# EasyEDA Pro project evenVCO.eprj, board PCB2_2
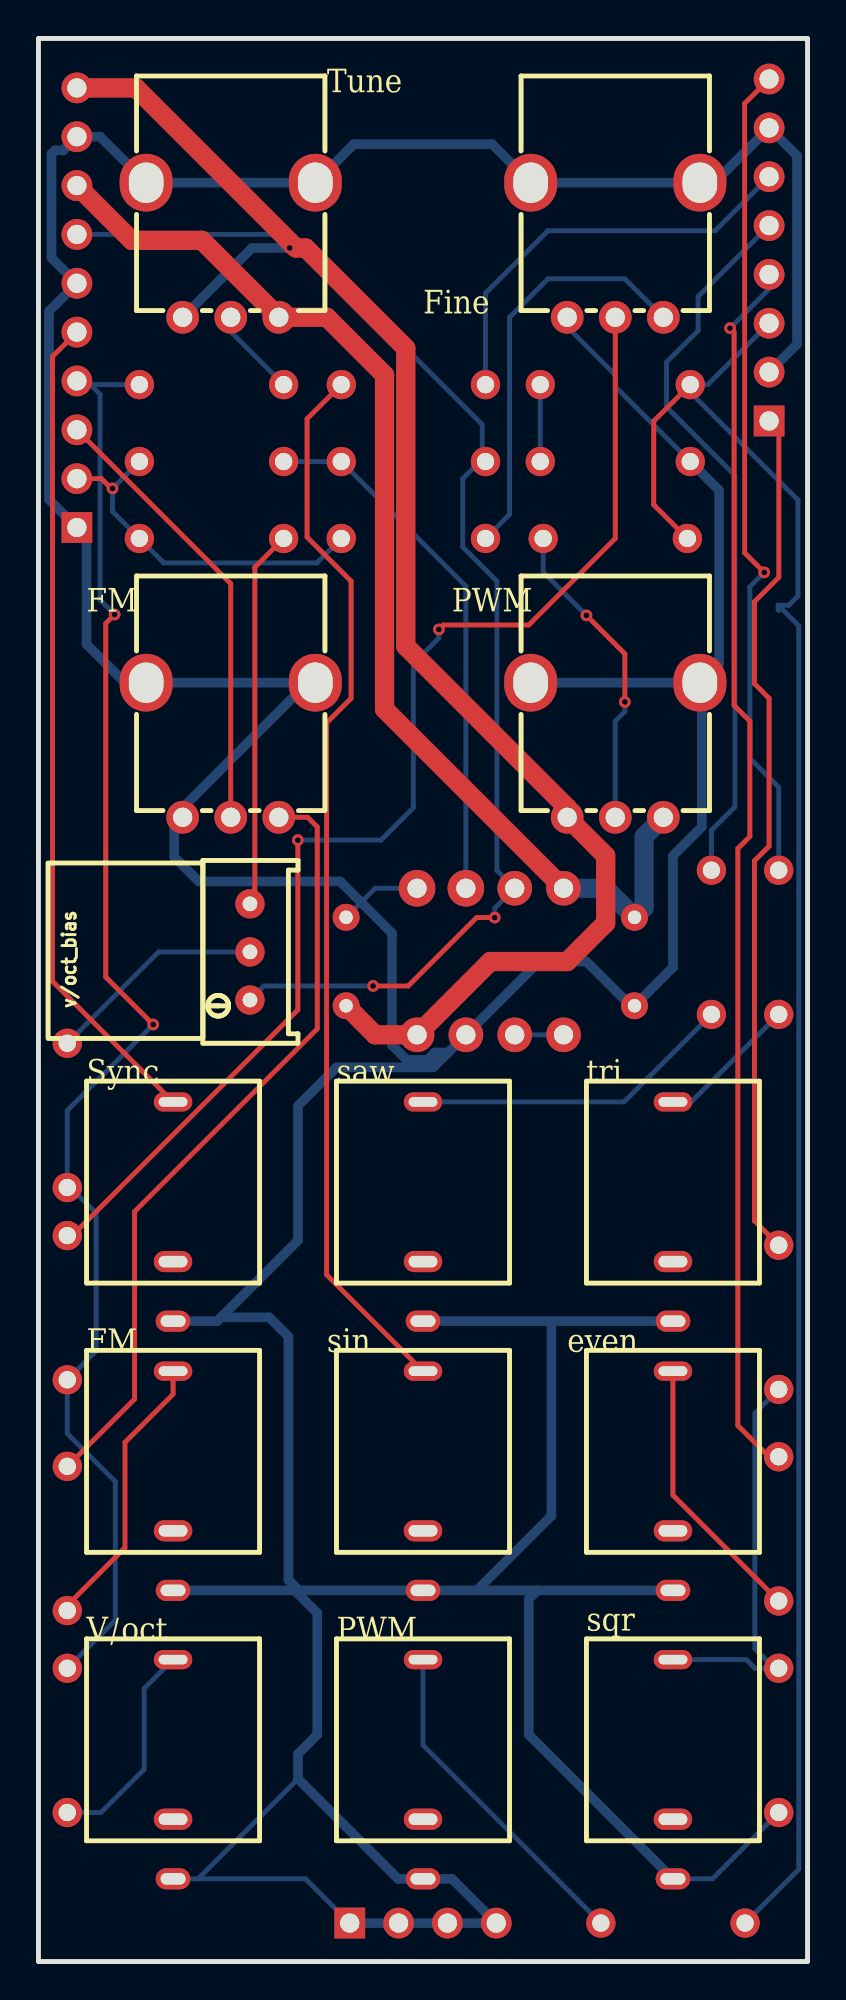
[diagram p12: board, top side]
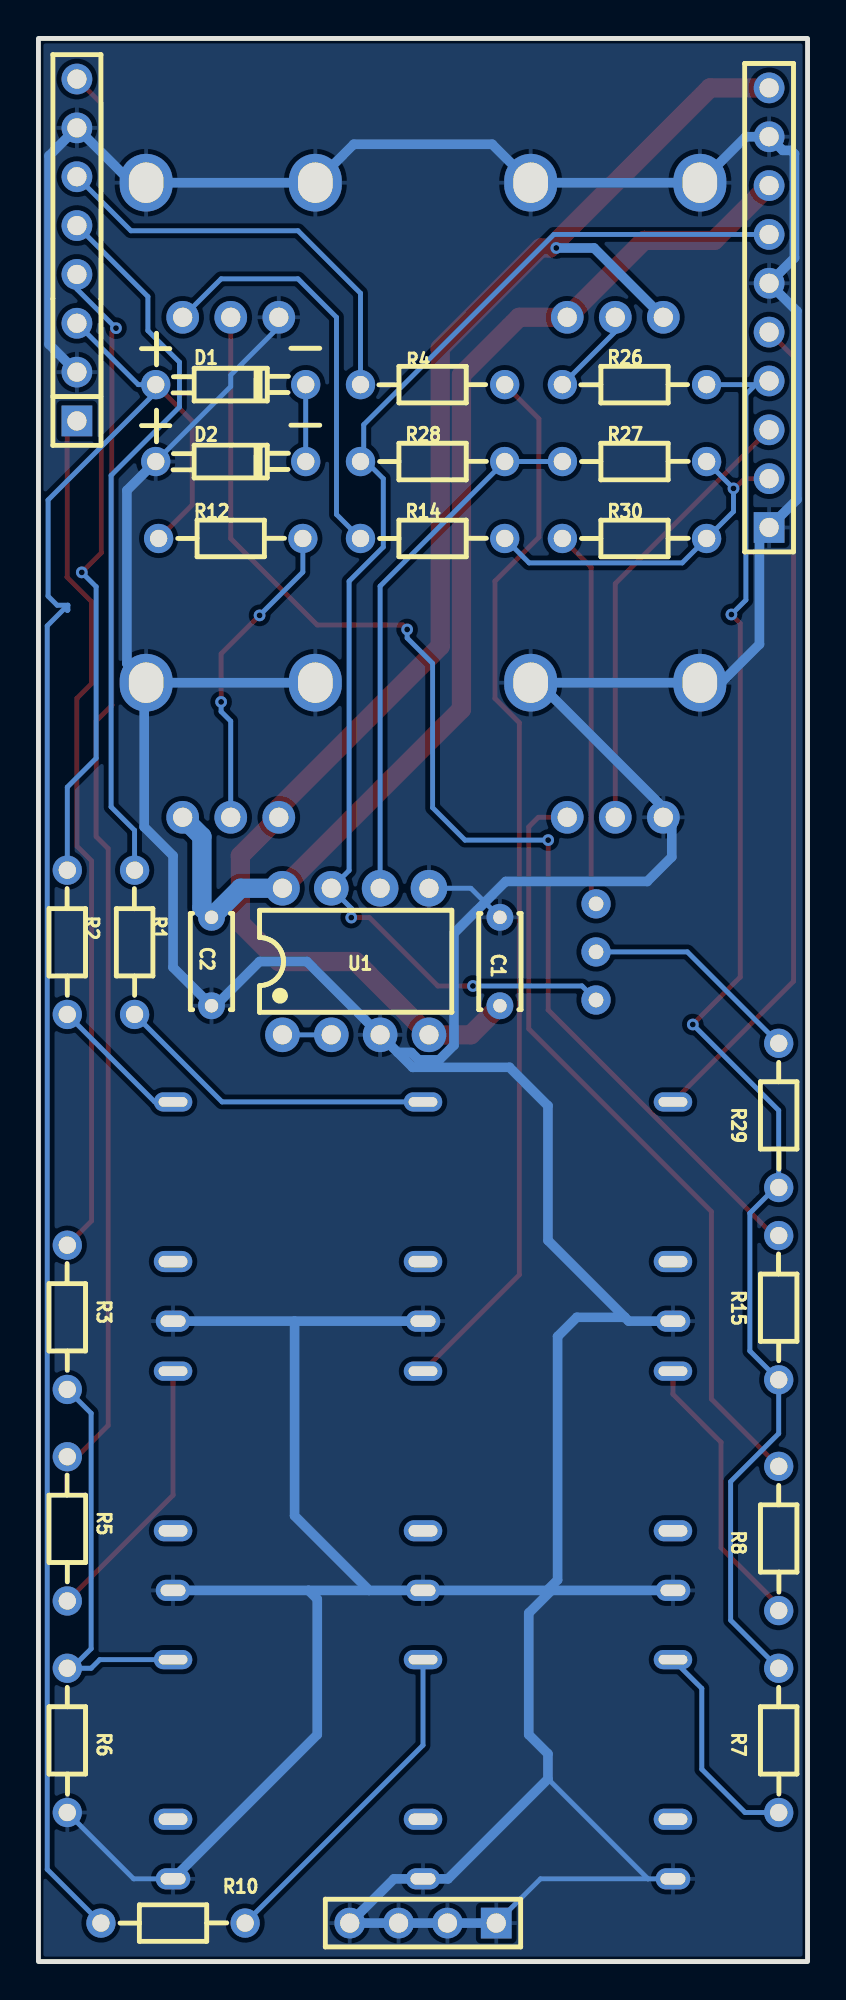
[diagram p13: board, bottom side, seen from below]

Outline 40 x 100 mm; copper layers: Top Layer, Bottom Layer. Coordinates in mm from the lower left corner of the outline.
Outline path: rectangle 0,100 40,0
Stack: Top Layer 0.035mm / Dielectric1 1.51mm FR4 er 4.5 / Bottom Layer 0.035mm

## Design rules (mm)
template: Custom Config
spacing copperThickness1oz (default): track to track 0.102, other pairs 0.152 to 0.3
spacing copperThickness2oz: track to track 0.203, other pairs 0.152 to 0.3
track width copperThickness1oz (default): min 0.127, default 0.254, max 2.54
track width copperThickness2oz: min 0.203, default 0.254, max 2.54
differential pair differentialPair (default): width min 0.127, default 0.254, max 2.54; gap min 0.152, default 0.152
via viaSize (default): diameter min 0.5, default 0.61, max 10; hole min 0.3, default 0.305, max 6.3

## Placement (name value [footprint] x y rotation side)
C1  100nF  [CAP-TH_L5.0-W2.1-P4.60-D0.4]  16 52 270 bottom
C2  100nF  [CAP-TH_L5.0-W2.1-P4.60-D0.4]  31 52 90 bottom
D1  BZX55C4V7-TAP  [DO-35_BD1.7-L3.8-P7.8-D0.5-FD]  30 82 180 bottom
D2  BZX55C4V7-TAP  [DO-35_BD1.7-L3.8-P7.8-D0.5-FD]  30 78 180 bottom
even  WQP-WQP518MA  [CONN-TH_WQP-WQP518MA]  33 25 0 top
Fine  100kΩ  [RES-ADJ-TH_RK09D1130C3C]  30 89 0 top
FM  WQP-WQP518MA  [RES-ADJ-TH_RK09D1130C3C]  10 63 0 top
FM#2  -  [CONN-TH_WQP-WQP518MA]  7 25 0 top
H1  HTSW-110-07-G-S  [HDR-TH_TSW-110-17-F-S-LL]  2 86 90 bottom
H2  HTSW-108-22-T-S  [HDR-TH_HTSW-108-22-T-S]  38 89 90 bottom
H3  HTSW-104-18-F-S  [HDR-TH_HTSW-104-25-S-S-LL]  20 2 180 bottom
PWM  WQP-WQP518MA  [RES-ADJ-TH_RK09D1130C3C]  30 63 0 top
PWM#2  -  [CONN-TH_WQP-WQP518MA]  20 10 0 top
R1  1k  [RES-TH_BD1.9-L3.5-P7.50-D0.5]  35 53 270 bottom
R2  1k  [RES-TH_BD1.9-L3.5-P7.50-D0.5]  38.5 53 270 bottom
R3  3.3k  [RES-TH_BD1.9-L3.5-P7.50-D0.5]  38.5 33.5 270 bottom
R4  1k  [RES-TH_BD1.9-L3.5-P7.50-D0.5]  19.5 82 180 bottom
R5  1k  [RES-TH_BD1.9-L3.5-P7.50-D0.5]  38.5 22.5 270 bottom
R6  3.3k  [RES-TH_BD1.9-L3.5-P7.50-D0.5]  38.5 11.5 90 bottom
R7  100k 0.1%  [RES-TH_BD1.9-L3.5-P7.50-D0.5]  1.5 11.5 90 bottom
R8  100K  [RES-TH_BD1.9-L3.5-P7.50-D0.5]  1.5 22 90 bottom
R10  47k  [RES-TH_BD1.9-L3.5-P7.50-D0.5]  33 2 0 bottom
R12  12k  [RES-TH_BD1.9-L3.5-P7.50-D0.5]  30 74 0 bottom
R14  130k  [RES-TH_BD1.9-L3.5-P7.50-D0.5]  19.5 74 0 bottom
R15  100k  [RES-TH_BD1.9-L3.5-P7.50-D0.5]  1.5 34 270 bottom
R26  50k .1%  [RES-TH_BD1.9-L3.5-P7.50-D0.5]  9 82 180 bottom
R27  10K  [RES-TH_BD1.9-L3.5-P7.50-D0.5]  9 78 0 bottom
R28  10K  [RES-TH_BD1.9-L3.5-P7.50-D0.5]  19.5 78 0 bottom
R29  100k  [RES-TH_BD1.9-L3.5-P7.50-D0.5]  1.5 44 90 bottom
R30  36k  [RES-TH_BD1.9-L3.5-P7.50-D0.5]  9 74 0 bottom
saw  WQP-WQP518MA  [CONN-TH_WQP-WQP518MA]  20 39 0 top
sin  WQP-WQP518MA  [CONN-TH_WQP-WQP518MA]  20 25 0 top
sqr  WQP-WQP518MA  [CONN-TH_WQP-WQP518MA]  33 10 0 top
Sync  WQP-WQP518MA  [CONN-TH_WQP-WQP518MA]  7 39 0 top
tri  WQP-WQP518MA  [CONN-TH_WQP-WQP518MA]  33 39 0 top
Tune  100kΩ  [RES-ADJ-TH_RK09D1130C3C]  10 89 0 top
U1  TL082CP  [PDIP-8_L9.6-W6.4-P2.54-LS7.6-BL]  23.5 52 180 bottom
V/oct  WQP-WQP518MA  [CONN-TH_WQP-WQP518MA]  7 10 0 top
v/oct_bias  10kΩ  [RES-ADJ-TH_3P-L10.0-W10.0-P2.50-L]  11 52.5 90 top

## Footprints (pads in the part's own frame, mm; a bottom-side part is the same pattern mirrored in y, then rotated)
CAP-TH_L5.0-W2.1-P4.60-D0.4
  round 1.4 hole 0.7: 1(-2.3,0) 2(2.3,0)
CONN-TH_WQP-WQP518MA
  oval 1.8x1.1 hole 1.3x0.6: 1(0,-5.7)
  oval 2x1.1 hole 1.5x0.6: 2(0,-2.6)
  oval 2x1 hole 1.5x0.5: 3(0,5.7)
DO-35_BD1.7-L3.8-P7.8-D0.5-FD
  round 1.524 hole 0.9: 1(3.9,0) 2(-3.9,0)
HDR-TH_HTSW-104-25-S-S-LL
  rect 1.6x1.6 hole 1: 1(3.81,0)
  round 1.6 hole 1: 2(1.27,0) 3(-1.27,0) 4(-3.81,0)
HDR-TH_HTSW-108-22-T-S
  rect 1.6x1.6 hole 1: 1(-8.89,0)
  round 1.6 hole 1: 2(-6.35,0) 3(-3.81,0) 4(-1.27,0) 5(1.27,0) 6(3.81,0) 7(6.35,0) 8(8.89,0)
HDR-TH_TSW-110-17-F-S-LL
  rect 1.6x1.6 hole 1: 1(-11.43,0)
  round 1.6 hole 1: 2(-8.89,0) 3(-6.35,0) 4(-3.81,0) 5(-1.27,0) 6(1.27,0) 7(3.81,0) 8(6.35,0) 9(8.89,0) 10(11.43,0)
PDIP-8_L9.6-W6.4-P2.54-LS7.6-BL
  round 1.8 hole 1: 1(-3.81,-3.81) 2(-1.27,-3.81) 3(1.27,-3.81) 4(3.81,-3.81) 7(-1.27,3.81) 8(-3.81,3.81)
  round 1.905 hole 1: 5(3.81,3.81) 6(1.27,3.81)
RES-ADJ-TH_3P-L10.0-W10.0-P2.50-L
  round 1.524 hole 0.762: 1(-2.5,0) 2(0,0) 3(2.5,0)
RES-ADJ-TH_RK09D1130C3C
  round 1.7 hole 1: 1(-2.5,-3.5) 2(0,-3.5) 3(2.5,-3.5)
  oval 2.75x3 hole 1.8x2.1: 4(-4.4,3.5) 5(4.4,3.5)
RES-TH_BD1.9-L3.5-P7.50-D0.5
  round 1.524 hole 0.9: 1(-3.75,0) 2(3.75,0)

## Nets
+12V: C2.2 H1.8 PWM.3 Tune.3 U1.8
-12V: C1.2 H1.10 PWM.1 Tune.1 U1.4
GND: C1.1 C2.1 D2.2 even.1 Fine.1 Fine.4 Fine.5 FM.1 FM.4 FM.5 FM#2.1 H1.1 H1.6 H1.9 H2.2 H2.7 H3.1 H3.2 H3.3 H3.4 PWM.4 PWM.5 PWM#2.1 R6.1 saw.1 sin.1 sqr.1 Sync.1 tri.1 Tune.4 Tune.5 U1.3 U1.5 V/oct.1
-V_REF: H1.7 R28.2 U1.7 v/oct_bias.1
EVEN_OUT: H2.4 R5.1
FM_IN: FM.2 H1.3
PW_IN: D1.2 H2.3 R10.2 R12.2
PW_OUT: H2.1 R3.1
SAW_OUT: H2.5 R1.1
SIN_OUT: H2.6 R4.1
SYNC: H1.5 Sync.3
TRI_OUT: H2.8 R2.1
V_OCT_IN: H1.4 R7.2 R15.2 R26.2 R29.1
V_REF: H1.2 R14.1 R27.1 R30.1
$1N379: R1.2 saw.3
$1N459: R2.2 tri.3
$1N485: R3.2 R6.2 sqr.3
$1N511: R4.2 sin.3
$1N537: even.3 R5.2
$1N977: R7.1 V/oct.3
$1N1003: FM#2.3 R8.1
$1N1055: PWM#2.3 R10.1
$1N1199: PWM.2 R12.1
$1N1336: D1.1 D2.1
$1N1651: Fine.2 R15.1
$1N2918: R27.2 R28.1 U1.6
$1N3569: R26.1 Tune.2
$1N5861: R29.2 v/oct_bias.2
$1N5947: R30.2 v/oct_bias.3
$1N8161: U1.1 U1.2
$1N8571: FM.3 R8.2
$1N12657: Fine.3 R14.2

Pads without a net: even 2; FM#2 2; PWM#2 2; saw 2; sin 2; sqr 2; Sync 2; tri 2; V/oct 2

## Via types
v1: diameter 0.61, hole 0.305, Top Layer to Bottom Layer, 12 vias

## Routing (per net, layer and track width the routed paths; a pad name or vN(x,y) marks a point on that pad's centre or on a via; arc(x,y) is an arc through that point)
+12V: length 60.8
  Top Layer w1: H1.8 4.85,89.5 8.5,89.5 Tune.3 15,85.5 18,82.5 18,65.12 U1.8
  Bottom Layer w1: U1.8 29.49,55.81 C2.2 31.5,54.8 31.5,58.5 PWM.3
-12V: length 80.5
  Top Layer w1: H1.10 5.07,97.43 13.4,89.11 13.9,89.11 19.1,83.9 19.1,68.4 27.5,60 PWM.1 29.5,57.5 29.5,54 27.5,52 23.5,52 U1.4 17.51,48.19 C1.2
  Bottom Layer w0.5: v1(13.07,89.11) 11.11,89.11 Tune.1
GND: length 367
  Bottom Layer w0.254: Fine.1 27.5,85 30,82.5 30,81.9 D2.2 ; U1.5 17.51,55.81 C1.1 ; H3.1 13.89,4.3 8.3,4.3 ; 8.3,4.3 V/oct.1 ; 8.3,4.3 13.5,9.5 ; sqr.1 35.05,4.3 R6.1
  Bottom Layer w0.5: 13.55,19.3 13,19.85 13,32.5 12,33.5 9.5,33.5 ; 13.55,19.3 sin.1 22.8,19.3 ; 13.55,19.3 13.32,19.3 ; 21.31,47.27 20.61,47.27 20.23,46.89 19.15,46.89 18.39,47.65 18.39,53.47 16.78,55.08 15.69,56.16 8.34,56.16 7.06,57.44 7.06,59.06 FM.1 7.5,60 14,66.5 ; PWM.5 PWM.4 ; PWM.5 35.4,67.5 35.4,76.5 D2.2 ; PWM.5 34.5,66.4 34.5,59 33,57.5 33,51.7 C2.1 30.8,49.7 28.5,52 26.04,52 U1.3 20.54,46.5 15.5,46.5 13.5,44.5 13.5,37.5 9.5,33.5 ; 25.95,19.3 even.1 ; 25.95,19.3 25.5,18.85 25.5,11.8 sqr.1 ; 25.95,19.3 22.8,19.3 ; 9.5,33.5 9.3,33.3 Sync.1 ; 22.8,19.3 26.68,23.18 26.68,33.3 ; tri.1 26.68,33.3 ; 26.68,33.3 saw.1 ; H3.1 H3.2 H3.3 H3.4 21.51,4.3 PWM#2.1 18.7,4.3 13.5,9.5 13.5,10.8 14.5,11.8 14.5,18.12 13.32,19.3 ; 14,66.5 4.5,66.5 2.5,68.5 2.5,74.07 0.55,76.02 0.55,85.82 H1.6 0.68,88.59 0.68,94 0.86,94.18 1.29,94.18 H1.9 3.21,94.89 Tune.4 Tune.5 16.4,94.5 23.6,94.5 Fine.4 35.15,92.5 H2.7 39.45,93.9 39.45,84.1 H2.2 ; 14,66.5 FM.5 ; 13.32,19.3 FM#2.1
-V_REF: length 67.5
  Top Layer w0.254: v1(17.4,50.73) 19.23,50.73 22.79,54.29 v1(23.73,54.29)
  Bottom Layer w0.254: v1(17.4,50.73) 11.73,50.73 v/oct_bias.1 ; H1.7 13.19,89.81 23.08,79.92 23.08,78.13 ; 23.08,78.13 22.07,77.11 22.07,73.55 23.84,71.78 23.84,56.74 U1.7 23.73,54.77 v1(23.73,54.29) ; 23.08,78.13 R28.2
EVEN_OUT: length 64.2
  Top Layer w0.254: R5.1 38,26.25 36.37,27.88 36.37,57.87 37,58.5 37,64.5 36.18,65.32 36.18,84.72 v1(35.97,84.94)
  Bottom Layer w0.254: v1(35.97,84.94) 38,86.97 H2.4
FM_IN: length 23.5
  Top Layer w0.254: H1.3 10,71.65 FM.2
PW_IN: length 99.9
  Top Layer w0.254: R12.2 32,75.75 32,80.1 D1.2
  Bottom Layer w0.254: 38.47,70.53 39.03,70.53 39.5,71 39.5,76 33.9,81.6 D1.2 34.81,82 H2.3 ; 38.47,70.53 39.54,69.46 39.54,4.79 R10.2 ; 38.47,70.53 38.47,70.28 38.5,70.25
PW_OUT: length 44.8
  Top Layer w0.254: H2.1 38.51,79.6 38.51,71.98 37.24,70.71 37.24,66.45 38,65.69 38,58 37.24,57.24 37.24,38.51 R3.1
SAW_OUT: length 37.7
  Bottom Layer w0.254: H2.5 34.31,86.58 34.31,84.81 32.67,83.17 32.67,80.83 36.22,77.28 36.22,60.04 35,58.82 R1.1
SIN_OUT: length 22
  Bottom Layer w0.254: H2.6 35.19,90 26.5,90 23.25,86.75 R4.1
SYNC: length 43.2
  Top Layer w0.254: H1.5 0.73,83.46 0.73,50.97 Sync.3
TRI_OUT: length 43
  Top Layer w0.254: H2.8 36.73,96.62 36.73,73.25 v1(37.75,72.24)
  Bottom Layer w0.254: v1(37.75,72.24) 37,71.49 37,62.57 38.5,61.07 R2.1
V_OCT_IN: length 77.1
  Top Layer w0.254: v1(5.97,48.73) 3.5,51.19 3.5,69.59 v1(3.96,70.05)
  Bottom Layer w0.254: 2.7,82 3.21,81.49 3.21,70.8 v1(3.96,70.05) ; 2.7,82 2.19,82 H1.4 ; 2.7,82 R26.2 ; 1.5,40.42 1.5,44.26 v1(5.97,48.73) ; 1.5,40.42 R29.1 ; 1.5,40.42 3,38.92 3,31.75 R15.2 1.5,27.46 4,24.96 4,17.75 R7.2
V_REF: length 18.8
  Top Layer w0.254: v1(3.85,76.6) 3.78,76.6 3.27,77.11 H1.2
  Bottom Layer w0.254: R14.1 14.48,72.73 6.52,72.73 R30.1 3.85,75.4 v1(3.85,76.6) R27.1
$1N379: length 16.9
  Bottom Layer w0.254: R1.2 30.45,44.7 saw.3
$1N459: length 7.4
  Bottom Layer w0.254: tri.3 33.95,44.7 R2.2
$1N485: length 21.1
  Bottom Layer w0.254: sqr.3 36.81,15.7 37.26,15.25 38.28,15.25 ; 38.28,15.25 R6.2 ; 38.28,15.25 37.26,16.27 37.26,28.51 R3.2
$1N511: length 55.6
  Top Layer w0.254: sin.3 14.99,35.71 14.99,64.41 16.26,65.68 16.26,71.78 13.97,74.07 13.97,80.22 R4.2
$1N537: length 14.2
  Top Layer w0.254: R5.2 33,24.25 even.3
$1N977: length 11.3
  Bottom Layer w0.254: R7.1 3.25,7.75 5.5,10 5.5,14.2 V/oct.3
$1N1003: length 14.7
  Top Layer w0.254: FM#2.3 7,29.5 4.5,27 4.5,21.52 1.5,18.52 R8.1
$1N1055: length 17.5
  Bottom Layer w0.254: PWM#2.3 20,11.25 R10.1
$1N1199: length 16.5
  Top Layer w0.254: v1(30.5,65.5) 30.5,68 v1(28.5,70)
  Bottom Layer w0.254: v1(28.5,70) 26.25,72.25 R12.1 ; PWM.2 30,64.5 30.5,65 v1(30.5,65.5)
$1N1336: length 4
  Bottom Layer w0.254: D1.1 D2.1
$1N1651: length 64.8
  Top Layer w0.254: v1(20.82,69.27) 21.06,69.5 25.5,69.5 30,74 Fine.2 ; R15.1 1.55,37.8 1.81,37.8 13.49,49.49 v1(13.49,58.31)
  Bottom Layer w0.254: v1(20.82,69.27) 20.82,68.82 19.5,67.5 19.5,60 17.81,58.31 v1(13.49,58.31)
$1N2918: length 27.9
  Bottom Layer w0.254: R27.2 R28.1 22.23,71.52 U1.6
$1N3569: length 4.6
  Bottom Layer w0.254: R26.1 10,84.75 Tune.2
$1N5861: length 11.5
  Bottom Layer w0.254: v/oct_bias.2 6.25,52.5 R29.2
$1N5947: length 19.7
  Top Layer w0.254: R30.2 11.25,72.5 11.25,55.25 v/oct_bias.3
$1N8161: length 2.5
  Bottom Layer w0.254: U1.1 U1.2
$1N8571: length 40.8
  Top Layer w0.254: R8.2 5,29.25 5,39 14.5,48.5 14.5,59 14,59.5 FM.3
$1N12657: length 21.7
  Bottom Layer w0.254: Fine.3 30.5,87.5 26.5,87.5 24.5,85.5 24.5,75.25 R14.2

## Copper pours and planes (outline as drawn; the poured copper is in the pictures)
GND on Bottom Layer: 0,100 40,100 40,0 0,0
